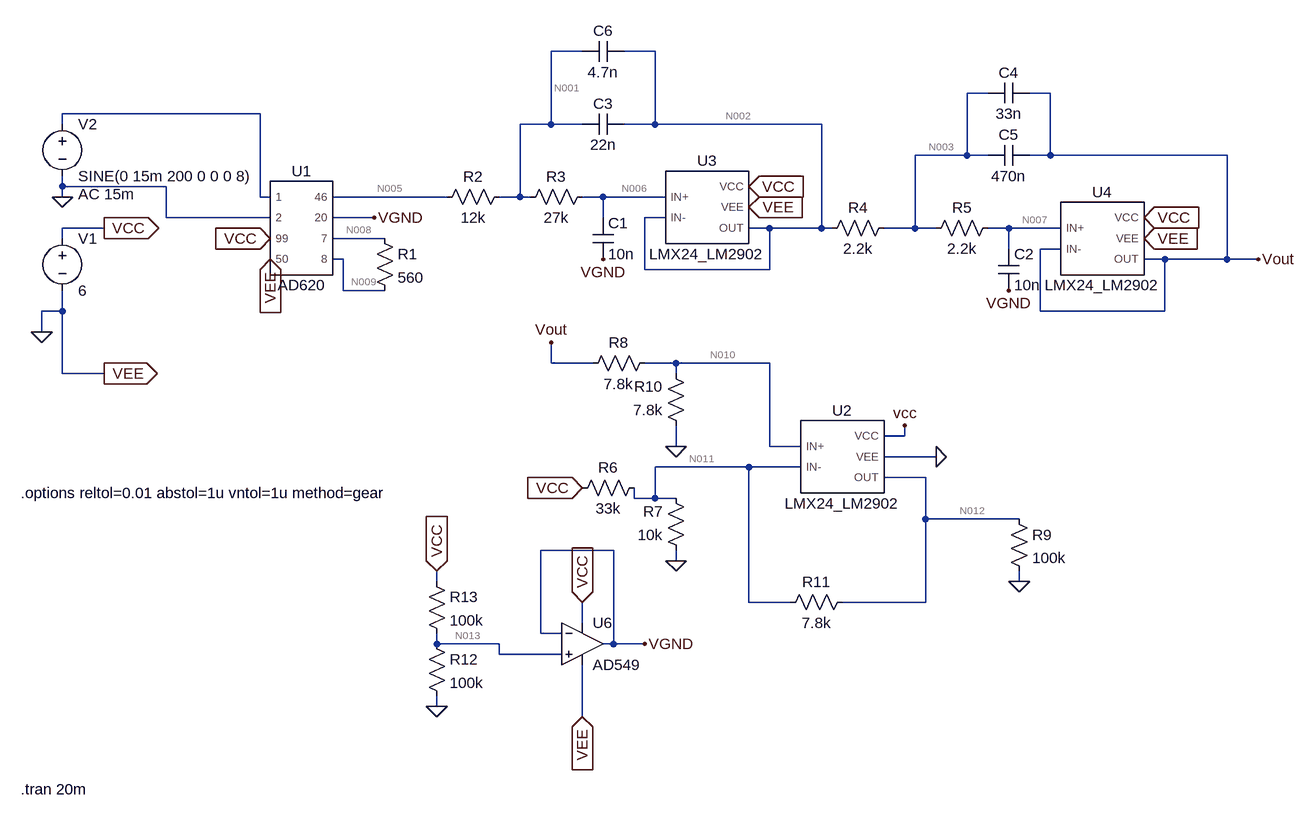
[diagram p0: schematic SMD_circuit.asc]
SMD_circuit.asc, the LTspice schematic file:
Version 4
SHEET 1 936 1024
WIRE -176 -128 -224 -128
WIRE -64 -128 -112 -128
WIRE 448 -64 416 -64
WIRE 544 -64 512 -64
WIRE -672 -32 -976 -32
WIRE -976 -16 -976 -32
WIRE -224 -16 -224 -128
WIRE -224 -16 -272 -16
WIRE -176 -16 -224 -16
WIRE -64 -16 -64 -128
WIRE -64 -16 -112 -16
WIRE 192 -16 -64 -16
WIRE 416 32 416 -64
WIRE 416 32 336 32
WIRE 448 32 416 32
WIRE 544 32 544 -64
WIRE 544 32 512 32
WIRE 816 32 544 32
WIRE -976 80 -976 64
WIRE -816 80 -976 80
WIRE -976 96 -976 80
WIRE -672 96 -672 -32
WIRE -656 96 -672 96
WIRE -384 96 -560 96
WIRE -272 96 -272 -16
WIRE -272 96 -304 96
WIRE -256 96 -272 96
WIRE -144 96 -176 96
WIRE -48 96 -144 96
WIRE -816 128 -816 80
WIRE -656 128 -816 128
WIRE -496 128 -560 128
WIRE -144 128 -144 96
WIRE -48 128 -80 128
WIRE -912 144 -976 144
WIRE 112 144 80 144
WIRE 192 144 192 -16
WIRE 192 144 112 144
WIRE 208 144 192 144
WIRE 336 144 336 32
WIRE 336 144 288 144
WIRE 368 144 336 144
WIRE 480 144 448 144
WIRE 560 144 480 144
WIRE -976 160 -976 144
WIRE -480 160 -560 160
WIRE 480 176 480 144
WIRE 560 176 528 176
WIRE -544 192 -560 192
WIRE 720 192 688 192
WIRE 816 192 816 32
WIRE 816 192 720 192
WIRE 864 192 816 192
WIRE -80 208 -80 128
WIRE 112 208 112 144
WIRE 112 208 -80 208
WIRE -544 240 -544 192
WIRE -480 240 -544 240
WIRE -976 272 -976 240
WIRE -976 272 -1008 272
WIRE 528 272 528 176
WIRE 720 272 720 192
WIRE 720 272 528 272
WIRE -1008 304 -1008 272
WIRE -224 352 -224 320
WIRE -160 352 -224 352
WIRE -32 352 -80 352
WIRE 112 352 -32 352
WIRE -976 368 -976 272
WIRE -912 368 -976 368
WIRE -32 368 -32 352
WIRE 320 464 320 448
WIRE 320 464 288 464
WIRE -32 480 -32 448
WIRE 112 480 112 352
WIRE 160 480 112 480
WIRE 368 496 288 496
WIRE 80 512 -64 512
WIRE 160 512 80 512
WIRE 352 528 288 528
WIRE -96 560 -96 544
WIRE -64 560 -64 512
WIRE -64 560 -96 560
WIRE -32 560 -64 560
WIRE 352 592 352 528
WIRE 496 592 352 592
WIRE -128 640 -240 640
WIRE -32 656 -32 640
WIRE -400 688 -400 672
WIRE 496 688 496 672
WIRE 80 720 80 512
WIRE 144 720 80 720
WIRE 352 720 352 592
WIRE 352 720 224 720
WIRE -176 752 -176 720
WIRE -240 768 -240 640
WIRE -208 768 -240 768
WIRE -400 784 -400 768
WIRE -304 784 -400 784
WIRE -128 784 -128 640
WIRE -128 784 -144 784
WIRE -80 784 -128 784
WIRE -304 800 -304 784
WIRE -208 800 -304 800
WIRE -400 880 -400 864
WIRE -176 896 -176 816
FLAG -912 144 VCC
IOPIN -912 144 Out
FLAG -912 368 VEE
IOPIN -912 368 Out
FLAG -656 192 VEE
IOPIN -656 192 In
FLAG -656 160 VCC
IOPIN -656 160 In
FLAG -1008 304 0
FLAG -496 128 VGND
FLAG -976 96 0
FLAG 80 80 VCC
IOPIN 80 80 In
FLAG 80 112 VEE
IOPIN 80 112 In
FLAG 688 128 VCC
IOPIN 688 128 In
FLAG 688 160 VEE
IOPIN 688 160 In
FLAG -144 192 VGND
FLAG 480 240 VGND
FLAG -80 784 VGND
FLAG -32 480 0
FLAG 496 688 0
FLAG 320 448 vcc
FLAG 368 496 0
FLAG -32 656 0
FLAG -176 544 VCC
IOPIN -176 544 In
FLAG 864 192 Vout
FLAG -224 320 Vout
FLAG -400 672 VCC
IOPIN -400 672 In
FLAG -176 720 VCC
IOPIN -176 720 In
FLAG -176 896 VEE
IOPIN -176 896 In
FLAG -400 880 0
SYMBOL AD620 -608 144 R0
SYMATTR InstName U1
SYMBOL voltage -976 144 R0
WINDOW 123 0 0 Left 0
WINDOW 39 0 0 Left 0
SYMATTR InstName V1
SYMATTR Value 6
SYMBOL res -496 144 R0
SYMATTR InstName R1
SYMATTR Value 560
SYMATTR SpiceLine tol=5
SYMBOL res -288 80 R90
WINDOW 0 0 56 VBottom 2
WINDOW 3 32 56 VTop 2
SYMATTR InstName R2
SYMATTR Value 12k
SYMATTR SpiceLine tol=5
SYMBOL voltage -976 -32 R0
WINDOW 123 24 124 Left 2
WINDOW 39 0 0 Left 0
SYMATTR Value2 AC 15m
SYMATTR InstName V2
SYMATTR Value SINE(0 15m 200 0 0 0 8)
SYMBOL LMX24_LM2902 16 112 R0
SYMATTR InstName U3
SYMBOL LMX24_LM2902 624 160 R0
SYMATTR InstName U4
SYMBOL res -160 80 R90
WINDOW 0 0 56 VBottom 2
WINDOW 3 32 56 VTop 2
SYMATTR InstName R3
SYMATTR Value 27k
SYMATTR SpiceLine tol=5
SYMBOL res 304 128 R90
WINDOW 0 0 56 VBottom 2
WINDOW 3 32 56 VTop 2
SYMATTR InstName R4
SYMATTR Value 2.2k
SYMATTR SpiceLine tol=5
SYMBOL res 464 128 R90
WINDOW 0 0 56 VBottom 2
WINDOW 3 32 56 VTop 2
SYMATTR InstName R5
SYMATTR Value 2.2k
SYMATTR SpiceLine tol=5
SYMBOL cap -160 128 R0
SYMATTR InstName C1
SYMATTR Value 10n
SYMBOL cap 464 176 R0
SYMATTR InstName C2
SYMATTR Value 10n
SYMBOL cap -112 -32 R90
WINDOW 0 0 32 VBottom 2
WINDOW 3 32 32 VTop 2
SYMATTR InstName C3
SYMATTR Value 22n
SYMBOL res -80 528 R90
WINDOW 0 0 56 VBottom 2
WINDOW 3 32 56 VTop 2
SYMATTR InstName R6
SYMATTR Value 33k
SYMATTR SpiceLine tol=5
SYMBOL res -16 656 R180
WINDOW 0 36 76 Left 2
WINDOW 3 36 40 Left 2
SYMATTR InstName R7
SYMATTR Value 10k
SYMATTR SpiceLine tol=5
SYMBOL LMX24_LM2902 224 496 R0
SYMATTR InstName U2
SYMBOL res -64 336 R90
WINDOW 0 0 56 VBottom 2
WINDOW 3 32 56 VTop 2
SYMATTR InstName R8
SYMATTR Value 7.8k
SYMATTR SpiceLine tol=5
SYMBOL res 480 576 R0
SYMATTR InstName R9
SYMATTR Value 100k
SYMBOL res -16 464 R180
WINDOW 0 36 76 Left 2
WINDOW 3 36 40 Left 2
SYMATTR InstName R10
SYMATTR Value 7.8k
SYMATTR SpiceLine tol=5
SYMBOL res 128 736 R270
WINDOW 0 32 56 VTop 2
WINDOW 3 0 56 VBottom 2
SYMATTR InstName R11
SYMATTR Value 7.8k
SYMATTR SpiceLine tol=5
SYMBOL res -416 768 R0
SYMATTR InstName R12
SYMATTR Value 100k
SYMBOL res -416 672 R0
SYMATTR InstName R13
SYMATTR Value 100k
SYMBOL OpAmps\\AD549 -176 720 R0
SYMATTR InstName U6
SYMBOL cap 512 -80 R90
WINDOW 0 0 32 VBottom 2
WINDOW 3 32 32 VTop 2
SYMATTR InstName C4
SYMATTR Value 33n
SYMBOL cap 512 16 R90
WINDOW 0 0 32 VBottom 2
WINDOW 3 32 32 VTop 2
SYMATTR InstName C5
SYMATTR Value 470n
SYMBOL cap -112 -144 R90
WINDOW 0 0 32 VBottom 2
WINDOW 3 32 32 VTop 2
SYMATTR InstName C6
SYMATTR Value 4.7n
TEXT -1040 552 Left 2 !.options reltol=0.01 abstol=1u vntol=1u method=gear
TEXT -1040 1008 Left 2 !.tran 20m

The netlist it stands for:
* SMD_circuit.asc
XU1 N004 0 VCC 0 N005 VGND N008 N009 AD620  ; pins 1 2 99 50 46 20 7 8
V1 VCC 0 6
R1 N008 N009 560 tol=5
R2 N001 N005 12k tol=5
V2 N004 0 SINE(0 15m 200 0 0 0 8) AC 15m
XU3 N006 N002 VCC 0 N002 LMX24_LM2902  ; pins IN+ IN- VCC VEE OUT
XU4 N007 Vout VCC 0 Vout LMX24_LM2902  ; pins IN+ IN- VCC VEE OUT
R3 N006 N001 27k tol=5
R4 N003 N002 2.2k tol=5
R5 N007 N003 2.2k tol=5
C1 N006 VGND 10n
C2 N007 VGND 10n
C3 N002 N001 22n
R6 N011 VCC 33k tol=5
R7 0 N011 10k tol=5
XU2 N010 N011 VCC 0 N012 LMX24_LM2902  ; pins IN+ IN- VCC VEE OUT
R8 N010 Vout 7.8k tol=5
R9 N012 0 100k
R10 0 N010 7.8k tol=5
R11 N011 N012 7.8k tol=5
R12 N013 0 100k
R13 VCC N013 100k
XU6 N013 VGND VCC 0 VGND AD549  ; pins In+ In- V+ V- OUT
C4 Vout N003 33n
C5 Vout N003 470n
C6 N002 N001 4.7n
.options reltol=0.01 abstol=1u vntol=1u method=gear
.tran 20m
.lib Z:\home\david\Documents\LTspice\PCB_filter\ad620.cir
.lib Z:\home\david\Documents\LTspice\PCB_filter\LMx24\lmx24_lm2902.lib
.backanno
.end

* Results of the author's LTspice run, read from the files saved beside the schematic
* Operating Point, zero values left out:
*   V(n008) = -637.2 mV
*   V(n009) = -637.2 mV
*   V(vcc) = 6 V
*   V(n005) = 3.001 V
*   V(vgnd) = 3 V
*   V(n001) = 3.002 V
*   V(n002) = 3.004 V
*   V(n006) = 3.002 V
*   V(vout) = 3.006 V
*   V(n007) = 3.004 V
*   V(n003) = 3.004 V
*   V(n011) = 1.505 V
*   V(n012) = 1.617 V
*   V(n010) = 1.503 V
*   V(n013) = 3 V
*   I(C1) = -1.155 pA
*   I(C2) = -1.144 pA
*   I(R1) = -26.56 nA
*   I(R2) = 20 nA
*   I(R3) = 20 nA
*   I(R4) = 20 nA
*   I(R5) = 20 nA
*   I(R6) = -136.2 µA
*   I(R7) = -150.5 µA
*   I(R8) = -192.7 µA
*   I(R9) = 16.17 µA
*   I(R10) = -192.7 µA
*   I(R11) = -14.31 µA
*   I(R12) = 30 µA
*   I(R13) = 30 µA
*   I(V1) = -2.641 mA
*   I(V2) = -646.8 pA
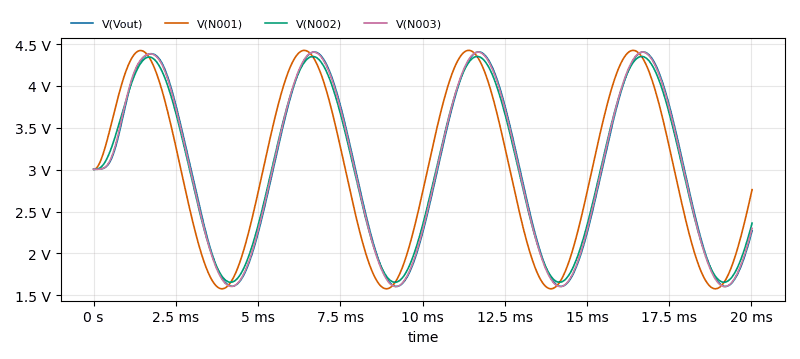
[diagram p1: Transient Analysis of SMD_circuit.asc, plotted from the saved traces]
* Transient Analysis, 1 run:
*   V(Vout): min 1.607 V, max 4.406 V, average 3.012 V, rms 3.169 V, last 2.27 V
*   V(N001): min 1.578 V, max 4.425 V, average 2.999 V, rms 3.162 V, last 2.762 V
*   V(N002): min 1.656 V, max 4.352 V, average 3.01 V, rms 3.157 V, last 2.362 V
*   V(N003): min 1.604 V, max 4.404 V, average 3.009 V, rms 3.167 V, last 2.301 V